# EasyEDA schematic SCH_带通滤波器.json
TITLE: 带通滤波器; REV: 1.0; Date: 2022-10-07; Sheet: 1/1; Drawn By: Banzhuan3721; Company: 垃圾桶
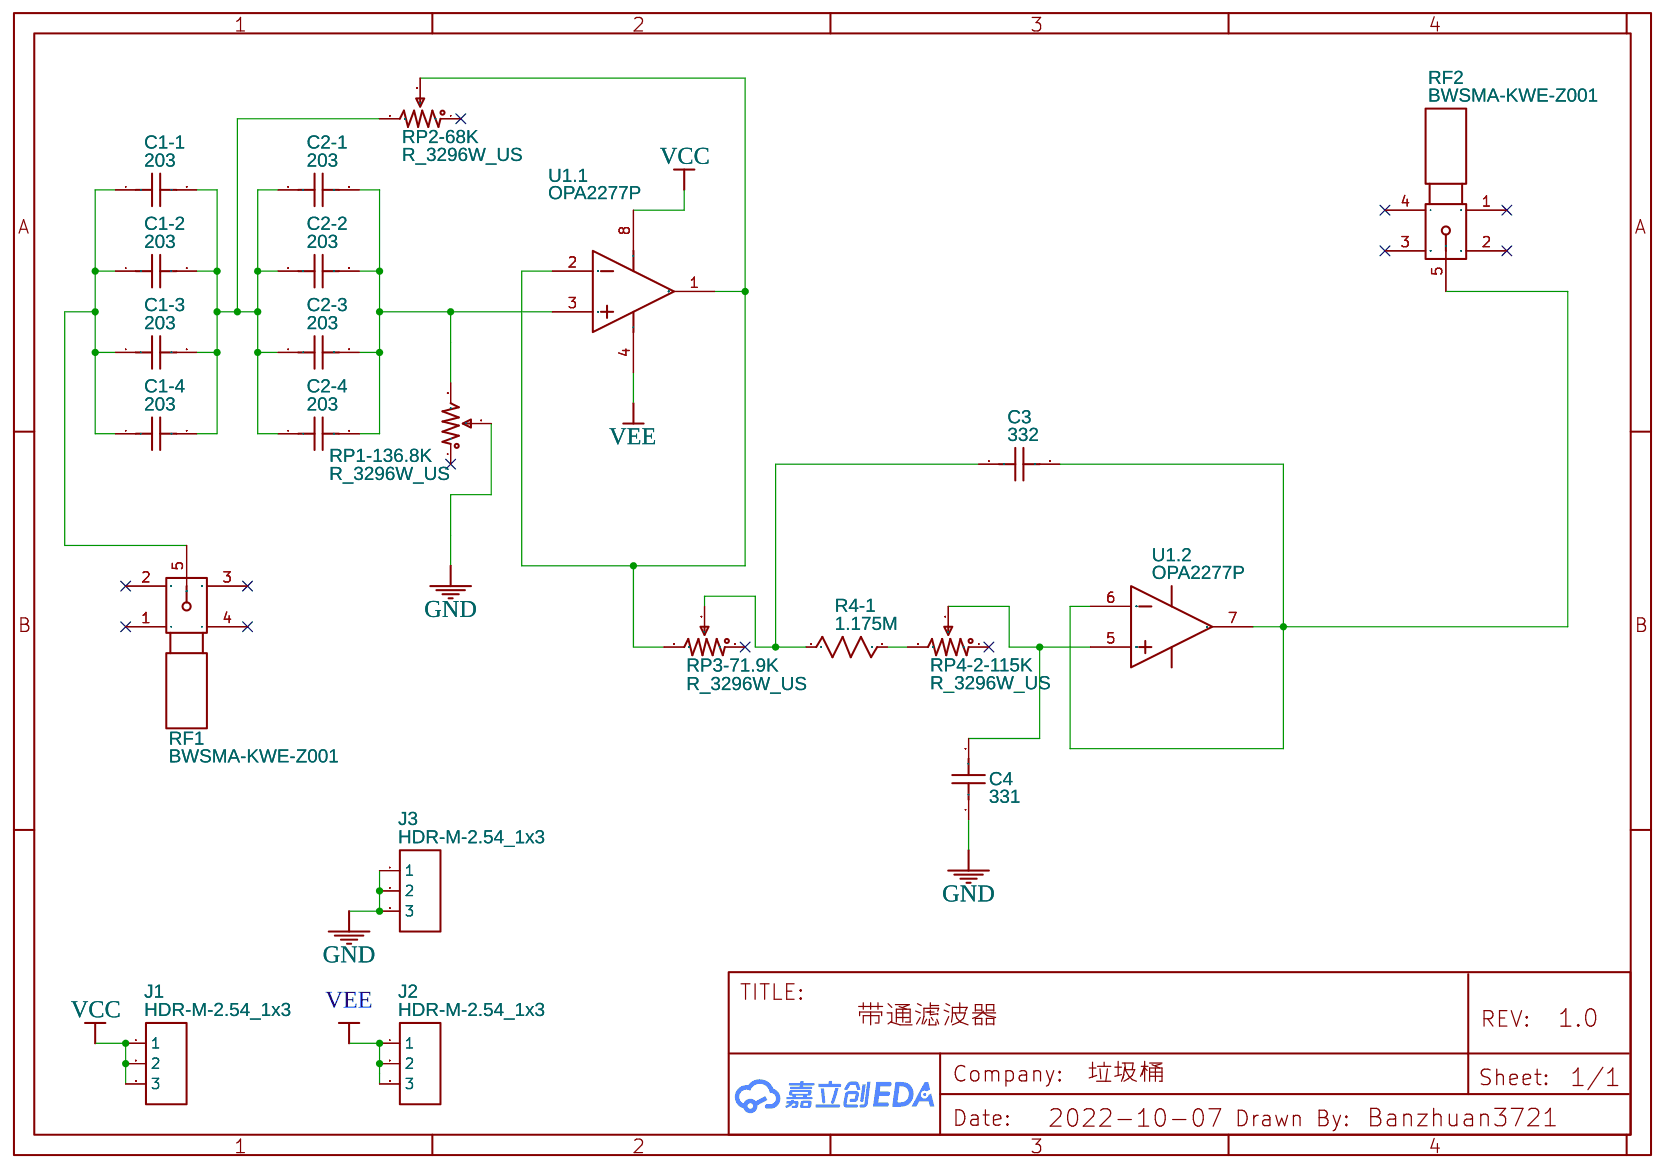
[diagram p0: schematic sheet]

## Parts
C1-1  203  [RAD-0.1]
C1-2  203  [RAD-0.1]
C1-3  203  [RAD-0.1]
C1-4  203  [RAD-0.1]
C2-1  203  [RAD-0.1]
C2-2  203  [RAD-0.1]
C2-3  203  [RAD-0.1]
C2-4  203  [RAD-0.1]
C3  332  [RAD-0.1]
C4  331  [RAD-0.1]
J1  HDR-M-2.54_1x3  [HDR-M-2.54_1X3]
J2  HDR-M-2.54_1x3  [HDR-M-2.54_1X3]
J3  HDR-M-2.54_1x3  [HDR-M-2.54_1X3]
R4-1  1.175M  [R_AXIAL-0.3]
RF1  BWSMA-KWE-Z001  [SMA-TH_BWSMA-KWE-Z001]
RF2  BWSMA-KWE-Z001  [SMA-TH_BWSMA-KWE-Z001]
RP1-136.8K  R_3296W_US  [RES-ADJ-TH_3296W]
RP2-68K  R_3296W_US  [RES-ADJ-TH_3296W]
RP3-71.9K  R_3296W_US  [RES-ADJ-TH_3296W]
RP4-2-115K  R_3296W_US  [RES-ADJ-TH_3296W]
U1  OPA2277P  [PDIP-8_L9.3-W6.4-P2.54-LS7.6-BL]  (sections 1,2)

## Library data of the parts
C1-1-C1-4 C2-1-C2-4 C3 C4 = C_RAD-0.2_US: Contributor: LCEDA_Lib
J1-J3 = HDR-M-2.54_1x3: Supplier Part: C180248; Supplier: LCSC; Contributor: LCEDA_Lib
R4-1 = R_AXIAL-0.3_US: Contributor: LCEDA_Lib
RF1 RF2 = BWSMA-KWE-Z001: Supplier: LCSC; Supplier Part: C496551; Manufacturer: BAT WIRELESS; Contributor: LCSC; JLCPCB Part Class: Extended Part
RP1-136.8K RP2-68K RP3-71.9K RP4-2-115K = R_3296W_US: Supplier: LCSC; Contributor: LCEDA_Lib; value(Ω): 10K
U1 = OPA2277P: Supplier: LCSC; Supplier Part: C1346538; Manufacturer: TI(德州仪器); subpart_no: 1

## Nets
GND: C4.1 J3.1 J3.2 J3.3 RP1-136.8K.2
VCC: J1.1 J1.2 J1.3 U1.8(V+)
VEE: J2.1 J2.2 J2.3 U1.4(V-)
Net-(C1-1-1): C1-1.1 C1-2.1 C1-3.1 C1-4.1 RF1.5
Net-(C1-1-2): C1-1.2 C1-2.2 C1-3.2 C1-4.2 C2-1.1 C2-2.1 C2-3.1 C2-4.1 RP2-68K.3
Net-(C2-1-2): C2-1.2 C2-2.2 C2-3.2 C2-4.2 RP1-136.8K.3 U1.3(+INA)
Net-(C3-1): C3.1 R4-1.1 RP3-71.9K.2
Net-(C3-2): C3.2 RF2.5 U1.6(-INB) U1.7(OUTB)
Net-(C4-2): C4.2 RP4-2-115K.2 U1.5(+INB)
Net-(R4-1-2): R4-1.2 RP4-2-115K.3
Net-(RP2-68K-2): RP2-68K.2 RP3-71.9K.3 U1.1(OUTA) U1.2(-INA)

Not connected (* = marked no-connect by the designer): RF1 1* 2* 3* 4*; RF2 1* 2* 3* 4*; RP1-136.8K 1*; RP2-68K 1*; RP3-71.9K 1*; RP4-2-115K 1*
